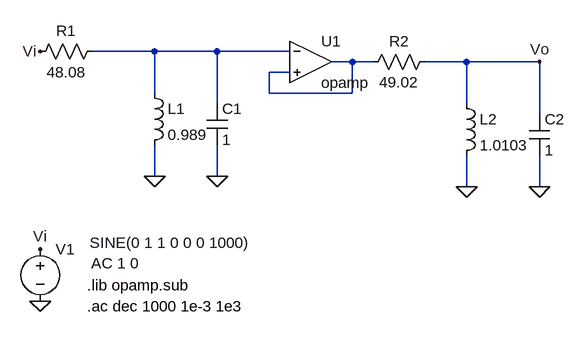
[diagram p0: schematic circuito.asc]
circuito.asc, the LTspice schematic file:
Version 4
SHEET 1 984 680
WIRE -240 -96 -336 -96
WIRE -144 -96 -240 -96
WIRE -32 -96 -144 -96
WIRE 64 -80 32 -80
WIRE 96 -80 64 -80
WIRE 240 -80 176 -80
WIRE 352 -80 240 -80
WIRE -32 -64 -64 -64
WIRE -240 -32 -240 -96
WIRE -64 -32 -64 -64
WIRE 64 -32 64 -80
WIRE 64 -32 -64 -32
WIRE -144 -16 -144 -96
WIRE 240 -16 240 -80
WIRE 352 0 352 -80
WIRE -240 96 -240 48
WIRE -144 96 -144 48
WIRE 240 112 240 64
WIRE 352 112 352 64
FLAG 352 -80 Vo
FLAG -416 -96 Vi
FLAG -416 288 0
FLAG -416 208 Vi
FLAG -240 96 0
FLAG -144 96 0
FLAG 240 112 0
FLAG 352 112 0
SYMBOL ind -256 -48 R0
SYMATTR InstName L1
SYMATTR Value 0.989
SYMBOL cap -160 -16 R0
SYMATTR InstName C1
SYMATTR Value 1
SYMBOL res -320 -112 R90
WINDOW 0 0 56 VBottom 2
WINDOW 3 32 56 VTop 2
SYMATTR InstName R1
SYMATTR Value 48.08
SYMBOL res 192 -96 R90
WINDOW 0 0 56 VBottom 2
WINDOW 3 32 56 VTop 2
SYMATTR InstName R2
SYMATTR Value 49.02
SYMBOL ind 224 -32 R0
SYMATTR InstName L2
SYMATTR Value 1.0103
SYMBOL cap 336 0 R0
SYMATTR InstName C2
SYMATTR Value 1
SYMBOL Opamps\\opamp 0 -144 R0
SYMATTR InstName U1
SYMBOL voltage -416 192 R0
WINDOW 3 76 6 Left 2
WINDOW 123 78 38 Left 2
WINDOW 39 0 0 Left 0
SYMATTR InstName V1
SYMATTR Value SINE(0 1 1 0 0 0 1000)
SYMATTR Value2 AC 1 0
TEXT -344 264 Left 2 !.lib opamp.sub
TEXT -344 296 Left 2 !.ac dec 1000 1e-3 1e3

The netlist it stands for:
* circuito.asc
L1 N001 0 0.989
C1 N001 0 1
R1 N001 Vi 48.08
R2 Vo N002 49.02
L2 Vo 0 1.0103
C2 Vo 0 1
XU1 N001 N002 N002 opamp Aol=100K GBW=10Meg  ; pins invin noninvin out
V1 Vi 0 SINE(0 1 1 0 0 0 1000) AC 1 0
.lib opamp.sub
.ac dec 1000 1e-3 1e3
.backanno
.end